# Altium schematic sheet ltc1474_100mA.SchDoc
size A4
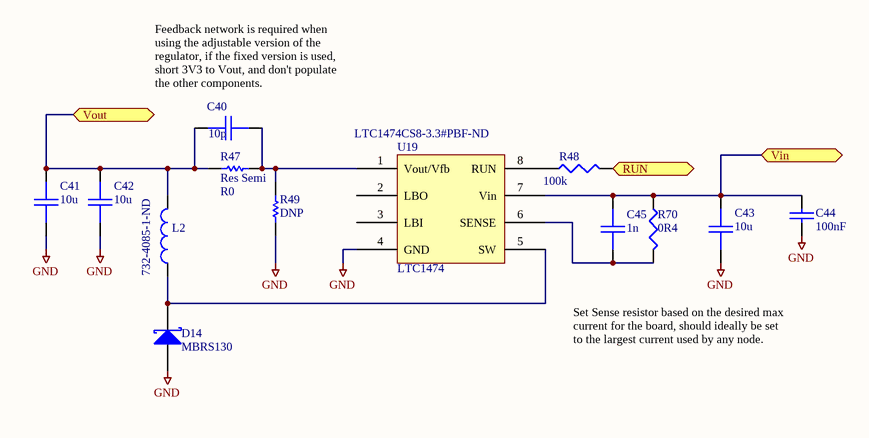
[diagram p0: ltc1474_100mA.SchDoc]

## Parts
C40  10p  [0603]
C41  10u  [1206]
C42  10u  [1206]
C43  10u  [1206]
C44  100nF  [0603]
C45  1n  [0603]
D14  MBRS130  [SMB]
L2  Supplier Part Number 1: 732-4085-1-ND  [WE-TPC-744042331]  (hidden comment: INDUCTOR)
R47  Res Semi  value R0  [0603]
R48  100k  [0603]
R49  DNP  [0603]
R70  0R4  [0603]
U19  LTC1474  Supplier Part Number 1: LTC1474CS8-3.3#PBF-ND  [SO8]

## Ports
RUN, Vin, Vout

## Nets
GND: C41.2 C42.2 C43.2 C44.2 D14.A R49.1 U19.4(GND)
RUN: R48.2 ; port RUN
Vin: C43.1 C44.1 C45.1 R70.1 U19.7(Vin) ; port Vin
Vout: C40.1 C41.1 C42.1 L2.2 R47.1 ; port Vout
NetC40_2: C40.2 R47.2 R49.2 U19.1(Vout/Vfb)
NetC45_2: C45.2 R70.2 U19.6(SENSE)
NetD14_K: D14.K L2.1 U19.5(SW)
NetR48_1: R48.1 U19.8(RUN)

Not connected (* = marked no-connect by the designer): U19 2(LBO) 3(LBI)

## Notes on the sheet
- (near C40) Feedback network is required when using the adjustable version of the regulator, if the fixed version is used, short 3V3 to Vout, and don't populate the other components.
- Set Sense resistor based on the desired max current for the board, should ideally be set to the largest current used by any node.

## Library data of the parts
C40 = CAP: Capacitor; Manufacturer: TDK Corporation; Manufacturer Part Number: C1608C0G1H100D080AA; Value: 1nF; Description: CAP CER 10PF 50V NP0 0603; Capacitance: 10pF; Voltage - Rated: 50V; Tolerance: ±0.5pF; Temperature Coefficient: C0G, NP0; Revision: July-2002: Re-released for DXP Platform.; Farnell: 317-202; Price: 0.15; Supplier 1: Digi-Key; Supplier Part Number 1: 445-1269-1-ND; RoHS: RoHS Compliant; Category: Capacitors; Stock 1: 206915; Pricing 1: 1=0.12, 10=0.043, 100=0.0198, 250=0.01624, 500=0.0139, 1000=0.01082 (AUD); Packaging: Cut Tape (CT); Mounting Type: Surface Mount, MLCC; Operating Temperature: -55°C ~ 125°C; Applications: General Purpose; Ratings: -; Package / Case: 0603 (1608 Metric); Size / Dimension: 0.063" L x 0.031" W (1.60mm x 0.80mm); Height - Seated (Max): -; Thickness (Max): 0.037" (0.95mm); Lead Spacing: -; Features: -; Lead Style: -; ComponentLink1URL: http://product.tdk.com/capacitor/mlcc/en/documents/mlcc_commercial_general_en.pdf; ComponentLink1Description: http://product.tdk.com/capacitor/mlcc/en/documents/mlcc_commercial_general_en.pdf
C41-C43 = CAP: Capacitor; Manufacturer: TDK Corporation; Manufacturer Part Number: C3216X5R1A106M160AB; Description: CAP CER 10UF 10V 20% X5R 1206; Capacitance: 10µF; Voltage - Rated: 10V; Tolerance: ±20%; Temperature Coefficient: X5R; Supplier 1: Digi-Key; Supplier Part Number 1: 445-1387-1-ND; RoHS: RoHS Compliant; Category: Capacitors; Stock 1: 132841; Pricing 1: 1=0.32, 10=0.274, 100=0.137, 250=0.10276, 500=0.09076, 1000=0.0805 (AUD); Packaging: Cut Tape (CT); Mounting Type: Surface Mount, MLCC; Operating Temperature: -55°C ~ 85°C; Applications: General Purpose; Ratings: -; Package / Case: 1206 (3216 Metric); Size / Dimension: 0.126" L x 0.063" W (3.20mm x 1.60mm); Height - Seated (Max): -; Thickness (Max): 0.071" (1.80mm); Lead Spacing: -; Features: -; Lead Style: -; ComponentLink1URL: http://product.tdk.com/capacitor/mlcc/en/documents/mlcc_commercial_general_en.pdf; ComponentLink1Description: http://product.tdk.com/capacitor/mlcc/en/documents/mlcc_commercial_general_en.pdf
C44 = CAP: Capacitor; Manufacturer: TDK Corporation; Manufacturer Part Number: C1608X7R1H103K080AA; Needed?: NO - HW LAB; Description: CAP CER 10000PF 50V 10% X7R 0603; Capacitance: 10000pF; Voltage - Rated: 50V; Tolerance: ±10%; Temperature Coefficient: X7R; Value: 100nF; Supplier 1: Digi-Key; Supplier Part Number 1: 445-1311-1-ND; RoHS: RoHS Compliant; Category: Capacitors; Stock 1: 569984; Pricing 1: 1=0.14, 10=0.035, 100=0.0159, 250=0.01296, 500=0.0111, 1000=0.00865 (AUD); Packaging: Cut Tape (CT); Mounting Type: Surface Mount, MLCC; Operating Temperature: -55°C ~ 125°C; Applications: General Purpose; Ratings: -; Package / Case: 0603 (1608 Metric); Size / Dimension: 0.063" L x 0.031" W (1.60mm x 0.80mm); Height - Seated (Max): -; Thickness (Max): 0.037" (0.95mm); Lead Spacing: -; Features: -; Lead Style: -; ComponentLink1URL: http://product.tdk.com/capacitor/mlcc/en/documents/mlcc_commercial_general_en.pdf; ComponentLink1Description: http://product.tdk.com/capacitor/mlcc/en/documents/mlcc_commercial_general_en.pdf
C45 = CAP: Capacitor; Manufacturer: TDK Corporation; Manufacturer Part Number: CGA3E2X7R1H102K080AA; Value: 1nF; Description: CAP CER 1000PF 50V 10% X7R 0603; Capacitance: 1000pF; Voltage - Rated: 50V; Tolerance: ±10%; Temperature Coefficient: X7R; Revision: July-2002: Re-released for DXP Platform.; Farnell: 317-202; Price: 0.15; Supplier 1: Digi-Key; Supplier Part Number 1: 445-5659-1-ND; RoHS: RoHS Compliant; Category: Capacitors; Stock 1: 28744; Pricing 1: 1=0.12, 10=0.043, 100=0.0198, 250=0.01624, 500=0.0139, 1000=0.01082 (AUD); Packaging: Cut Tape (CT); Mounting Type: Surface Mount, MLCC; Operating Temperature: -55°C ~ 125°C; Applications: Automotive; Ratings: AEC-Q200; Package / Case: 0603 (1608 Metric); Size / Dimension: 0.063" L x 0.031" W (1.60mm x 0.80mm); Height - Seated (Max): -; Thickness (Max): 0.035" (0.90mm); Lead Spacing: -; Features: -; Lead Style: -; ComponentLink1URL: http://product.tdk.com/capacitor/mlcc/en/documents/mlcc_automotive_general_en.pdf; ComponentLink1Description: http://product.tdk.com/capacitor/mlcc/en/documents/mlcc_automotive_general_en.pdf
D14 = D SCHOTTKY: Schottky Diode; Manufacturer: Fairchild Semiconductor; Manufacturer Part Number: MBRS130L; Description: DIODE SCHOTTKY 30V 2A DO214AA; Voltage - DC Reverse (Vr) (Max): 30V; Current - Average Rectified (Io): 2A; Voltage - Forward (Vf) (Max) @ If: 445mV @ 2A; Speed: Fast Recovery =< 500ns, > 200mA (Io); Current - Reverse Leakage @ Vr: 1mA @ 30V; Revision: July-2002: Re-released for DXP Platform.; Farnell: 708-150; Price: 1.49; Supplier 1: Digi-Key; Supplier Part Number 1: MBRS130LFSCT-ND; RoHS: RoHS Compliant; Category: Discrete Semiconductor Products; Stock 1: 14124; Pricing 1: 1=0.54, 10=0.428, 25=0.3612, 100=0.2942, 250=0.24364, 500=0.20126, 1000=0.15074 (AUD); Packaging: Cut Tape (CT); Diode Type: Schottky; Reverse Recovery Time (trr): -; Capacitance @ Vr, F: -; Mounting Type: Surface Mount; Package / Case: DO-214AA, SMB; Supplier Device Package: DO-214AA (SMB); ComponentLink1URL: http://www.fairchildsemi.com/ds/MB/MBRS130L.pdf; ComponentLink1Description: http://www.fairchildsemi.com/ds/MB/MBRS130L.pdf
L2 = INDUCTOR: Manufacturer: Wurth Electronics Inc; Manufacturer Part Number: 744042331; Description: INDUCTOR POWER 330UH 150MA SMD; Type: Ferrite Core; Inductance: 330µH; Current Rating: 150mA; Current - Saturation: 130mA; Tolerance: ±30%; Material - Core: Ferrite; Shielding: Shielded; DC Resistance (DCR): 4.5 Ohm Max; Frequency - Self Resonant: 5.5MHz; Frequency - Test: 100kHz; Supplier 1: Digi-Key; RoHS: RoHS Compliant; Category: Inductors, Coils, Chokes; Stock 1: 1473; Pricing 1: 1=3.47, 10=3.239, 25=3.0072, 50=2.6374, 100=2.406, 250=2.1284 (AUD); Packaging: Cut Tape (CT); Q @ Freq: -; Operating Temperature: -40°C ~ 125°C; Package / Case: 1919 (4848 Metric); Size / Dimension: 0.189" L x 0.189" W x 0.071" H (4.80mm x 4.80mm x 1.80mm); Mounting Type: Surface Mount; ComponentLink1URL: http://katalog.we-online.de/pbs/datasheet/744042331.pdf; ComponentLink1Description: http://katalog.we-online.de/pbs/datasheet/744042331.pdf
R47 = Res Semi: Semiconductor Resistor; Manufacturer: Panasonic Electronic Components; Manufacturer Part Number: ERJ-3GEY0R00V; Description: RES 0.0 OHM 1/10W JUMP 0603 SMD; Resistance (Ohms): 0.0; Power (Watts): 0.1W, 1/10W; Tolerance: Jumper; Published: 8-Jun-2000; LatestRevisionDate: 17-Jul-2002; LatestRevisionNote: Re-released for DXP Platform.; PackageReference: AXIAL-0.5; Publisher: Altium Limited; PackageDescription: Axial Device, Thru-Hole; 2 Leads; 0.5 in Pin Spacing; Supplier 1: Digi-Key; Supplier Part Number 1: P0.0GCT-ND; RoHS: RoHS Compliant; Category: Resistors; Stock 1: 8823198; Pricing 1: 1=0.02, 50=0.011, 100=0.0084, 250=0.00624, 500=0.00462, 1000=0.00308 (AUD); Packaging: Cut Tape (CT); Composition: Thick Film; Features: -; Temperature Coefficient: -; Package / Case: 0603 (1608 Metric); Supplier Device Package: 0603; Size / Dimension: 0.063" L x 0.031" W (1.60mm x 0.80mm); Height: 0.022" (0.55mm); Number of Terminations: 2; ComponentLink1URL: http://industrial.panasonic.com/www-cgi/jvcr13pz.cgi?E+PZ+3+AOA0001+ERJ3GEY0R00V+7+WW; ComponentLink1Description: http://industrial.panasonic.com/www-cgi/jvcr13pz.cgi?E+PZ+3+AOA0001+ERJ3GEY0R00V+7+WW
R48 = RES1: Resistor; Manufacturer: Panasonic Electronic Components; Manufacturer Part Number: ERJ-3GEYJ104V; Description: RES 100K OHM 1/10W 5% 0603 SMD; Power (Watts): 0.1W, 1/10W; Temperature Coefficient: ±200ppm/°C; Tolerance: ±5%; Value: 100k; Farnell: 612-728; Price: 0.13; Supplier 1: Digi-Key; Supplier Part Number 1: P100KGCT-ND; RoHS: RoHS Compliant; Category: Resistors; Stock 1: 1297208; Pricing 1: 1=0.12, 50=0.011, 100=0.0084, 250=0.00624, 500=0.00462, 1000=0.00308 (AUD); Packaging: Cut Tape (CT); Resistance (Ohms): 100k; Composition: Thick Film; Features: -; Package / Case: 0603 (1608 Metric); Supplier Device Package: 0603; Size / Dimension: 0.063" L x 0.031" W (1.60mm x 0.80mm); Height: 0.022" (0.55mm); Number of Terminations: 2; ComponentLink1URL: http://industrial.panasonic.com/www-cgi/jvcr13pz.cgi?E+PZ+3+AOA0001+ERJ3GEYJ104V+7+WW; ComponentLink1Description: http://industrial.panasonic.com/www-cgi/jvcr13pz.cgi?E+PZ+3+AOA0001+ERJ3GEYJ104V+7+WW
R49 = Res Semi: Semiconductor Resistor; Value: R0; Published: 8-Jun-2000; LatestRevisionDate: 17-Jul-2002; LatestRevisionNote: Re-released for DXP Platform.; PackageReference: AXIAL-0.5; Publisher: Altium Limited; PackageDescription: Axial Device, Thru-Hole; 2 Leads; 0.5 in Pin Spacing
R70 = RES1: Resistor; Manufacturer: Yageo; Manufacturer Part Number: RL0603FR-070R4L; Value: 1.2R; Description: RES 0.4 OHM 1/10W 1% 0603 SMD; Resistance (Ohms): 0.4; Power (Watts): 0.1W, 1/10W; Temperature Coefficient: ±800ppm/°C; Tolerance: ±1%; Revision: July-2002: Re-released for DXP Platform.; Farnell: 360-2229; Price: 0.15; Supplier 1: Digi-Key; Supplier Part Number 1: 311-.4QCT-ND; RoHS: RoHS Compliant; Category: Resistors; Stock 1: 9678; Pricing 1: 1=0.49, 10=0.38, 25=0.2888, 100=0.1596, 250=0.13484, 500=0.11556, 1000=0.08806, 2500=0.08255 (AUD); Packaging: Cut Tape (CT); Composition: Thick Film; Features: Current Sense; Package / Case: 0603 (1608 Metric); Supplier Device Package: 0603; Size / Dimension: 0.063" L x 0.031" W (1.60mm x 0.80mm); Height: 0.022" (0.55mm); Number of Terminations: 2; ComponentLink1URL: http://www.yageo.com/documents/recent/PYu_RL_521_RoHS_L_v6.pdf; ComponentLink1Description: http://www.yageo.com/documents/recent/PYu_RL_521_RoHS_L_v6.pdf
U19 = LTC1474: Step-down converter; Manufacturer: Linear Technology; Manufacturer Part Number: LTC1474CS8-3.3#PBF; Description: IC REG BUCK 3.3V 0.75A 8SOIC; Output Type: Fixed; Number of Outputs: 1; Voltage - Output: 3.3V; Voltage - Input: 3 V ~ 18 V; PWM Type: Burst Mode®; Current - Output: 750mA; Synchronous Rectifier: No; Farnell: NA; Supplier 1: Digi-Key; RoHS: RoHS Compliant; Category: Integrated Circuits (ICs); Stock 1: 1575; Pricing 1: 1=8.3, 25=5.514, 100=4.3866 (AUD); Packaging: Tube; Type: Step-Down (Buck); Frequency - Switching: -; Operating Temperature: 0°C ~ 70°C; Mounting Type: Surface Mount; Package / Case: 8-SOIC (0.154", 3.90mm Width); Supplier Device Package: 8-SOIC; ComponentLink1URL: http://www.linear.com/docs/1377; ComponentLink1Description: http://www.linear.com/docs/1377